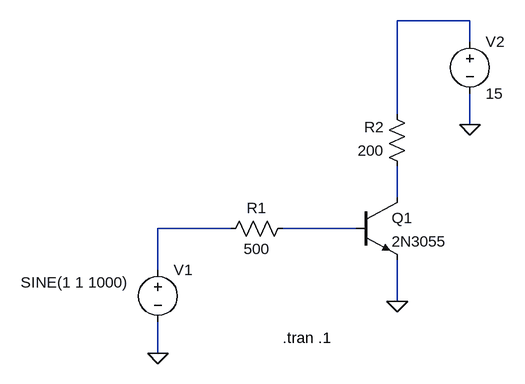
[diagram p0: schematic 2N3055-02.asc]
2N3055-02.asc, the LTspice schematic file:
Version 4.1
SHEET 1 880 680
WIRE 624 -320 512 -320
WIRE 624 -288 624 -320
WIRE 512 -176 512 -320
WIRE 624 -160 624 -208
WIRE 512 -48 512 -96
WIRE 256 0 144 0
WIRE 448 0 336 0
WIRE 144 64 144 0
WIRE 512 112 512 48
WIRE 144 192 144 144
FLAG 144 192 0
FLAG 512 112 0
FLAG 624 -160 0
SYMBOL voltage 144 48 R0
WINDOW 3 -211 35 Left 2
WINDOW 123 0 0 Left 0
WINDOW 39 0 0 Left 0
SYMATTR InstName V1
SYMATTR Value SINE(1 1 1000)
SYMBOL voltage 624 -304 R0
WINDOW 123 0 0 Left 0
WINDOW 39 0 0 Left 0
SYMATTR InstName V2
SYMATTR Value 15
SYMBOL npn 448 -48 R0
SYMATTR InstName Q1
SYMATTR Value 2N3055
SYMBOL res 352 -16 R90
WINDOW 0 0 56 VBottom 2
WINDOW 3 32 56 VTop 2
SYMATTR InstName R1
SYMATTR Value 500
SYMBOL res 528 -80 R180
WINDOW 0 36 76 Left 2
WINDOW 3 36 40 Left 2
SYMATTR InstName R2
SYMATTR Value 200
TEXT 336 168 Left 2 !.tran .1

The netlist it stands for:
* 2N3055-02.asc
V1 N003 0 SINE(1 1 1000)
V2 N001 0 15
Q1 N002 N004 0 0 2N3055
R1 N004 N003 500
R2 N002 N001 200
.model NPN NPN
.model PNP PNP
.lib standard.bjt
.tran .1
.backanno
.end